# EAGLE design tt-motor_driver_and_encoder (EAGLE 9.6.2)
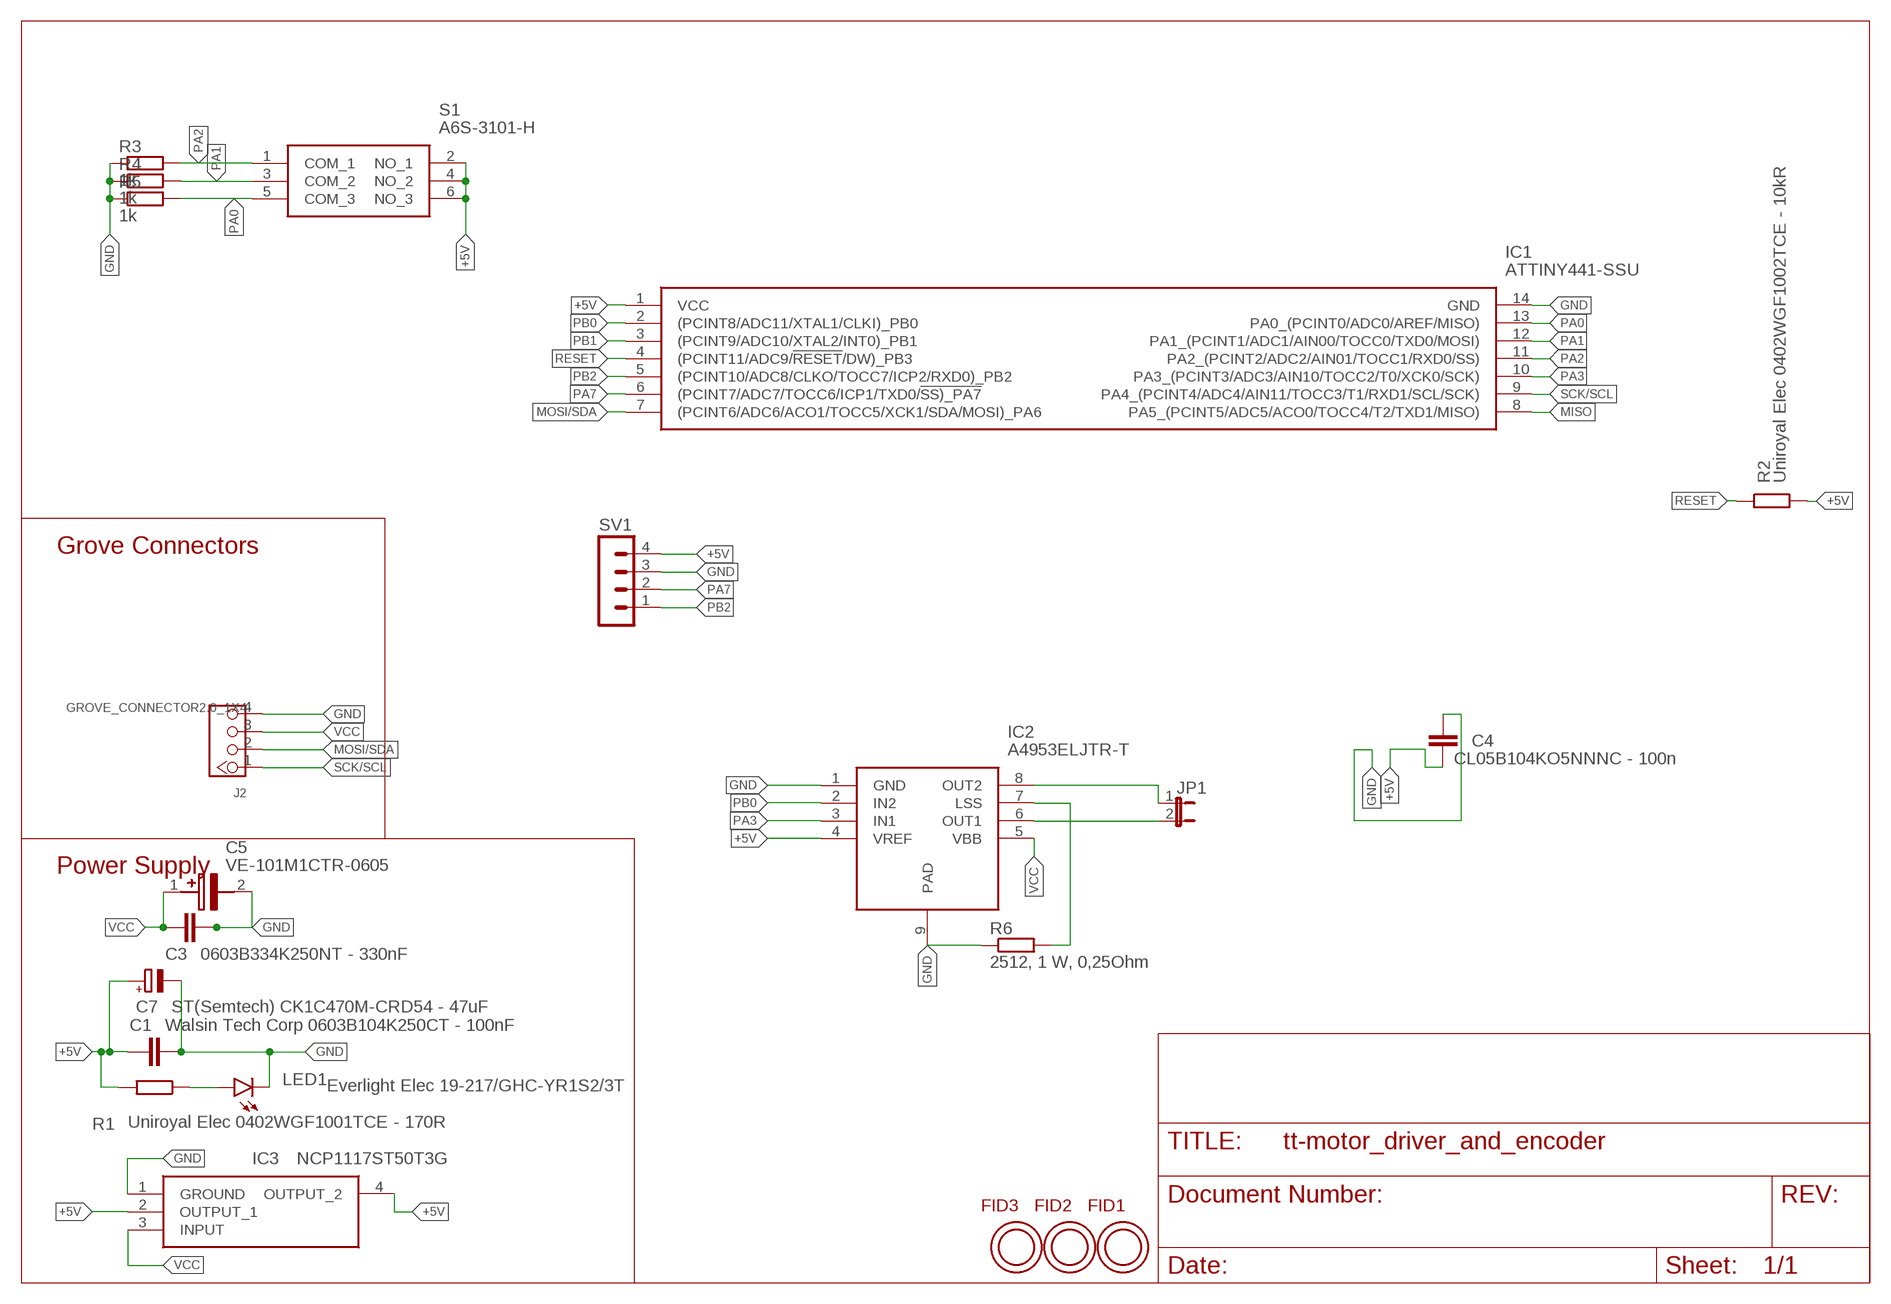
[diagram p0: schematic, sheet 1]

## Parts
C1  Walsin Tech Corp 0603B104K250CT - 100nF  C-EUC0603  [C0603]
C3  0603B334K250NT - 330nF  C-EUC0603  [C0603]
C4  CL05B104KO5NNNC - 100n  C-EUC0402  [C0402]
C5  VE-101M1CTR-0605  [CAPAE660X550N]
C7  ST(Semtech) CK1C470M-CRD54 - 47uF  CPOL-EUC  [PANASONIC_C]
FID1  OPEN-PNP-FIDUCIAL  [OPEN-PNP-FIDUCIAL]
FID2  OPEN-PNP-FIDUCIAL  [OPEN-PNP-FIDUCIAL]
FID3  OPEN-PNP-FIDUCIAL  [OPEN-PNP-FIDUCIAL]
IC1  ATTINY441-SSU  [SOIC127P600X175-14N]
IC2  A4953ELJTR-T  [SOIC127P600X170-9N]
IC3  NCP1117ST50T3G  [SOT230P700X180-4N]
J2  GROVE_CONNECTOR2.0_1X4  [2.0_1X4_STRAIGHT]
JP1  JP1E  [JP1]
LED1  Everlight Elec 19-217/GHC-YR1S2/3T  LEDCHIPLED_0603  [CHIPLED_0603]
R1  Uniroyal Elec 0402WGF1001TCE - 170R  R-EU_R0402  [R0402]
R2  Uniroyal Elec 0402WGF1002TCE - 10kR  R-EU_R0402  [R0402]
R3  1k  R-EU_R0402  [R0402]
R4  1k  R-EU_R0402  [R0402]
R5  1k  R-EU_R0402  [R0402]
R6  2512, 1 W, 0,25Ohm  R-EU_R2512  [R2512]
S1  A6S-3101-H  [A6S3104H]
SV1  MA04-1  [MA04-1]

## Nets
+5V: C1.1 C4.1 C7.+ IC1.1(VCC) IC2.4(VREF) IC3.2(OUTPUT_1) IC3.4(OUTPUT_2) R1.2 R2.2 S1.2(NO_1) S1.4(NO_2) S1.6(NO_3) SV1.4
GND: C1.2 C3.1 C4.2 C5.2(-) C7.- IC1.14(GND) IC2.1(GND) IC2.9(PAD) IC3.1(GROUND) J2.4 LED1.C R3.1 R4.1 R5.1 R6.1 SV1.3
MISO: IC1.8(PA5_(PCINT5/ADC5/ACO0/TOCC4/T2/TXD1/MISO))
MOSI/SDA: IC1.7((PCINT6/ADC6/ACO1/TOCC5/XCK1/SDA/MOSI)_PA6) J2.2
N$1: LED1.A R1.1
N$2: IC2.6(OUT1) JP1.2
N$3: IC2.8(OUT2) JP1.1
N$4: IC2.7(LSS) R6.2
PA0: IC1.13(PA0_(PCINT0/ADC0/AREF/MISO)) R5.2 S1.5(COM_3)
PA1: IC1.12(PA1_(PCINT1/ADC1/AIN00/TOCC0/TXD0/MOSI)) R4.2 S1.3(COM_2)
PA2: IC1.11(PA2_(PCINT2/ADC2/AIN01/TOCC1/RXD0/SS)) R3.2 S1.1(COM_1)
PA3: IC1.10(PA3_(PCINT3/ADC3/AIN10/TOCC2/T0/XCK0/SCK)) IC2.3(IN1)
PA7: IC1.6((PCINT7/ADC7/TOCC6/ICP1/TXD0/!SS)_PA7) SV1.2
PB0: IC1.2((PCINT8/ADC11/XTAL1/CLKI)_PB0) IC2.2(IN2)
PB1: IC1.3((PCINT9/ADC10/XTAL2/INT0)_PB1)
PB2: IC1.5((PCINT10/ADC8/CLKO/TOCC7/ICP2/RXD0)_PB2) SV1.1
RESET: IC1.4((PCINT11/ADC9/!RESET!/DW)_PB3) R2.1
SCK/SCL: IC1.9(PA4_(PCINT4/ADC4/AIN11/TOCC3/T1/RXD1/SCL/SCK)) J2.1
VCC: C3.2 C5.1(+) IC2.5(VBB) IC3.3(INPUT) J2.3

## Notes on the sheet
- Grove Connectors
- Power Supply

## Library data of the parts
C1 C3 C4 = rcl:C-EU: CAPACITOR, European symbol; SPICEPREFIX: C
C5 = samacsys:VE-101M1CTR-0605: Aluminum Electrolytic Capacitors - SMD 16 Volts 100uF 20% 6.3x5.3 Source: Datasheet <https://www.arrow.com/en/products/ve-101m1ctr-0605/lelon-electronics>; ARROW_PART_NUMBER: VE-101M1CTR-0605; ARROW_PRICE-STOCK: https://www.arrow.com/en/products/ve-101m1ctr-0605/lelon-electronics; DESCRIPTION: Aluminum Electrolytic Capacitors - SMD 16 Volts 100uF 20% 6.3x5.3; HEIGHT: 5.5mm; MANUFACTURER_NAME: Lelon; MANUFACTURER_PART_NUMBER: VE-101M1CTR-0605; MOUSER_PART_NUMBER: 140-VE101M1CTR0605; MOUSER_PRICE-STOCK: https://www.mouser.co.uk/ProductDetail/Lelon/VE-101M1CTR-0605/?qs=GtPRU6UQL8z3KVDPWnsarw%3D%3D
C7 = rcl:CPOL-EU: POLARIZED CAPACITOR, European symbol; SPICEPREFIX: C
FID1-FID3 = topo-eng:OPEN-PNP-FIDUCIAL
IC1 = samacsys:ATTINY441-SSU: 8-bit Microcontrollers - MCU 16MHz 0.150" 14 SOIC Source: Datasheet <http://docs-emea.rs-online.com/webdocs/1441/0900766b81441b76.pdf>; ARROW_PART_NUMBER: ATTINY441-SSU; ARROW_PRICE-STOCK: https://www.arrow.com/en/products/attiny441-ssu/microchip-technology; DESCRIPTION: 8-bit Microcontrollers - MCU 16MHz 0.150" 14 SOIC; HEIGHT: 1.75mm; MANUFACTURER_NAME: Microchip; MANUFACTURER_PART_NUMBER: ATTINY441-SSU; MOUSER_PART_NUMBER: 556-ATTINY441-SSU; MOUSER_PRICE-STOCK: https://www.mouser.co.uk/ProductDetail/Microchip-Technology-Atmel/ATTINY441-SSU/?qs=HVbQlW5zcXWQGPvGy4LqgA%3D%3D
IC2 = samacsys:A4953ELJTR-T: Full Bridge Motor Driver 8-Pin SOIC N EP Allegro Microsystems A4953ELJTR-T Brushed DC Motor Driver IC, 40 V 2A, 8-Pin SOIC Source: Datasheet <http://www.allegromicro.com/~/media/Files/Datasheets/A4950-Datasheet.ashx?la=en>; ARROW_PART_NUMBER: A4953ELJTR-T; ARROW_PRICE-STOCK: https://www.arrow.com/en/products/a4953eljtr-t/allegro-microsystems; DESCRIPTION: Full Bridge Motor Driver 8-Pin SOIC N EP Allegro Microsystems A4953ELJTR-T Brushed DC Motor Driver IC, 40 V 2A, 8-Pin SOIC; HEIGHT: 1.7mm; MANUFACTURER_NAME: Allegro Microsystems; MANUFACTURER_PART_NUMBER: A4953ELJTR-T
IC3 = samacsys:NCP1117ST50T3G: ON SEMICONDUCTOR - NCP1117ST50T3G - LDO, REG, 20VIN, 1A, 5V, 1%, SOT223-3 Source: Datasheet <http://www.onsemi.com/pub/Collateral/NCP1117-D.PDF>; ARROW_PART_NUMBER: NCP1117ST50T3G; ARROW_PRICE-STOCK: https://www.arrow.com/en/products/ncp1117st50t3g/on-semiconductor; DESCRIPTION: ON SEMICONDUCTOR - NCP1117ST50T3G - LDO, REG, 20VIN, 1A, 5V, 1%, SOT223-3; HEIGHT: 1.8mm; MANUFACTURER_NAME: ON Semiconductor; MANUFACTURER_PART_NUMBER: NCP1117ST50T3G; MOUSER_PART_NUMBER: 863-NCP1117ST50T3G; MOUSER_PRICE-STOCK: https://www.mouser.co.uk/ProductDetail/ON-Semiconductor/NCP1117ST50T3G?qs=Gev%252BmEvV0ib6dijy6U0dhQ%3D%3D
J2 = morphbot:GROVE_CONNECTOR: Seeedstudio Grove-Connector: 1 = SCL 2 = SDA 3 = VCC 4 = GND
JP1 = jumper:JP1E: JUMPER
LED1 = led:LED: LED OSRAM: - CHIPLED LG R971, LG N971, LY N971, LG Q971, LY Q971, LO R971, LY R971 LH N974, LH R974 LS Q976, LO Q976, LY Q976 LO Q996 - Hyper CHIPLED LW Q18S LB Q993, LB Q99A, LB R99A - SideLED LS A670, LO A670, LY A670, LG A670, LP A670 LB A673, LV A673, LT A673, LW A673 LH A674 LY A675 LS A676, LA A676, LO A676, LY A676, LW A676 LS A679, LY A679, LG A679 - Hyper Micro SIDELED® LS Y876, LA Y876, LO Y876, LY Y876 LT Y87S - SmartLED LW L88C, LW L88S LB L89C, LB L89S, LG L890 LS L89K, LO L89K, LY L89K LS L896, LA L896, LO L896, LY L896 - TOPLED LS T670, LO T670, LY T670, LG T670, LP T670 LSG T670, LSP T670, LSY T670, LOP T670, LYG T670 LG T671, LOG T671, LSG T671 LB T673, LV T673, LT T673, LW T673 LH T674 LS T676, LA T676, LO T676, LY T676, LB T676, LH T676, LSB T676, LW T676 LB T67C, LV T67C, LT T67C, LS T67K, LO T67K, LY T67K, LW E67C LS E67B, LA E67B, LO E67B, LY E67B, LB E67C, LV E67C, LT E67C LW T67C LS T679, LY T679, LG T679 LS T770, LO T770, LY T770, LG T770, LP T770 LB T773, LV T773, LT T773, LW T773 LH T774 LS E675, LA E675, LY E675, LS T675 LS T776, LA T776, LO T776, LY T776, LB T776 LHGB T686 LT T68C, LB T68C - Hyper Mini TOPLED® LB M676 - Mini TOPLED Santana® LG M470 LS M47K, LO M47K, LY M47K Source: http://www.osram.convergy.de LUXEON: - LUMILED® LXK2-PW12-R00, LXK2-PW12-S00, LXK2-PW14-U00, LXK2-PW14-V00 LXK2-PM12-R00, LXK2-PM12-S00, LXK2-PM14-U00 LXK2-PE12-Q00, LXK2-PE12-R00, LXK2-PE12-S00, LXK2-PE14-T00, LXK2-PE14-U00 LXK2-PB12-K00, LXK2-PB12-L00, LXK2-PB12-M00, LXK2-PB14-N00, LXK2-PB14-P00, LXK2-PB14-Q00 LXK2-PR12-L00, LXK2-PR12-M00, LXK2-PR14-Q00, LXK2-PR14-R00 LXK2-PD12-Q00, LXK2-PD12-R00, LXK2-PD12-S00 LXK2-PH12-R00, LXK2-PH12-S00 LXK2-PL12-P00, LXK2-PL12-Q00, LXK2-PL12-R00 Source: www.luxeon.com KINGBRIGHT: KA-3528ASYC Source: www.kingbright.com
R1-R6 = rcl:R-EU_: RESISTOR, European symbol; SPICEPREFIX: R
S1 = samacsys:A6S-3101-H: 3 Way Surface Mount DIP Switch 3P Source: Datasheet <https://omronfs.omron.com/en_US/ecb/products/pdf/en-a6s.pdf>; DESCRIPTION: 3 Way Surface Mount DIP Switch 3P; HEIGHT: 4.5mm; MANUFACTURER_NAME: Omron Electronics; MANUFACTURER_PART_NUMBER: A6S-3101-H; MOUSER_PART_NUMBER: 653-A6S-3101-H; MOUSER_PRICE-STOCK: https://www.mouser.co.uk/ProductDetail/Omron-Electronics/A6S-3101-H?qs=ZP3UR5XsUoc1g2fyRqfX8w%3D%3D
SV1 = con-lstb:MA04-1: PIN HEADER; OC_FARNELL: unknown; OC_NEWARK: unknown

## Board
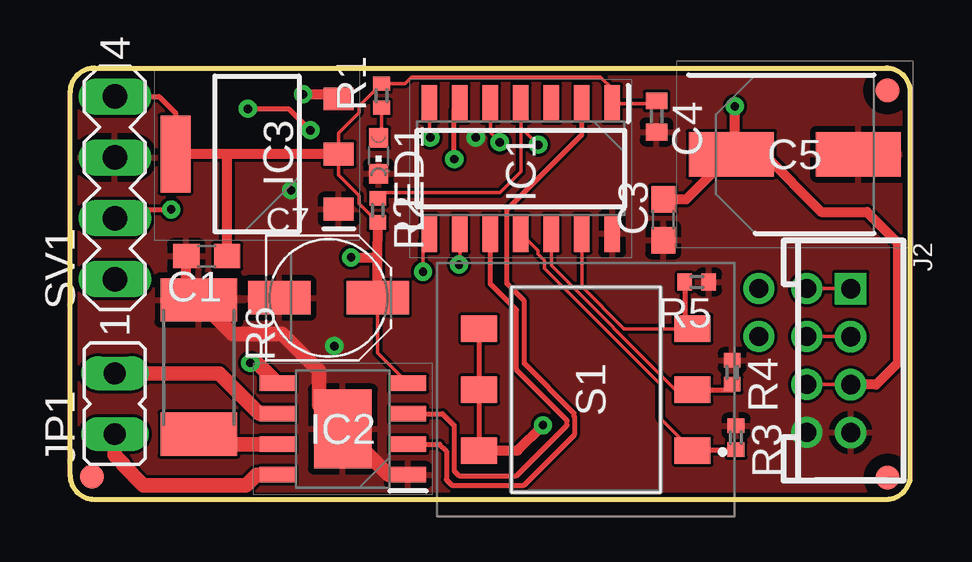
[diagram p1: board, top side]
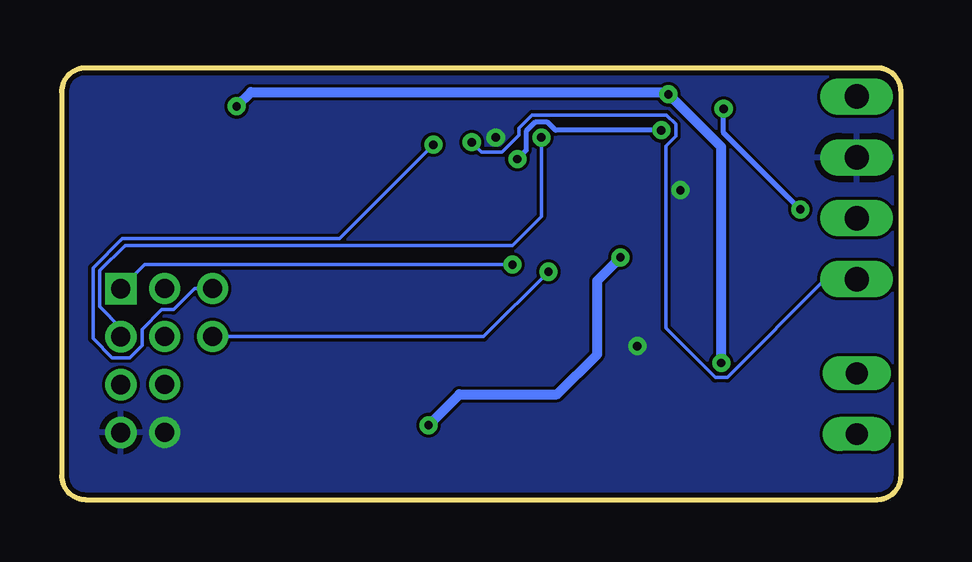
[diagram p2: board, bottom side, seen from below]

Size 35 x 18 mm. Coordinates in mm from the lower left corner, seen from the top.
Outline: 34,0 1,0 arc-90 0,1 0,17 arc-90 1,18 34,18 arc-90 35,17 35,1 arc-90 34,0
Copper layers (1*16): Top 0.035mm / dielectric 0.2mm / Bottom 0.035mm
Design rules "jlcpcb_4_layer *": minimum track width 3.5mil, minimum drill 0.2mm, track to track 5mil, track to pad 6mil, pad to pad 6mil, via to via 6mil, smd to smd 6mil, copper to edge 0.2mm, drill to drill 6mil, minimum pad ring 10mil, minimum via ring 8mil, stop-mask expansion 4mil, vias tented up to drill 0mil, thermal gap 10mil

### Footprints (pad centres in the part's own frame; a part is rotated, then mirrored left to right if it is on the bottom)
C0603 = smd 1.1 x 1: 1 -0.85,0; 2 0.85,0
C0402 = smd 0.7 x 0.9: 1 -0.65,0; 2 0.65,0
CAPAE660X550N = smd 3.55 x 1.85: 1 -2.65,0; 2 2.65,0
PANASONIC_C = smd 2.6 x 1.4: + 2.05,0; - -2.05,0
OPEN-PNP-FIDUCIAL = smd 1 x 1: FID$1 0,0
SOIC127P600X175-14N = smd 1.528 x 0.65: 1 -2.711,3.81; 2 -2.711,2.54; 3 -2.711,1.27; 4 -2.711,0; 5 -2.711,-1.27; 6 -2.711,-2.54; 7 -2.711,-3.81; 8 2.711,-3.81; 9 2.711,-2.54; 10 2.711,-1.27; 11 2.711,0; 12 2.711,1.27; 13 2.711,2.54; 14 2.711,3.81
SOIC127P600X170-9N = smd 1.525 x 0.65: 1 -2.712,1.905; 2 -2.712,0.635; 3 -2.712,-0.635; 4 -2.712,-1.905; 5 2.712,-1.905; 6 2.712,-0.635; 7 2.712,0.635; 8 2.712,1.905 | smd 2.41 x 3.3: 9 0,0
SOT230P700X180-4N = smd 1.25 x 0.95: 1 -3.4,2.3; 2 -3.4,0; 3 -3.4,-2.3 | smd 1.25 x 3.2: 4 3.4,0
2.0_1X4_STRAIGHT = drill 0.8 pad 1.27 square: 1 1.83,-1.786 | drill 0.8 pad 1.27: 2 3.83,-1.786; 3 5.83,-1.786; 4 7.83,-1.786
JP1 = drill 0.914 long: 1 0,-1.27; 2 0,1.27
CHIPLED_0603 = smd 0.8 x 0.8: A 0,-0.75; C 0,0.75
R0402 = smd 0.6 x 0.7: 1 -0.5,0; 2 0.5,0
R2512 = smd 1.8 x 3.2: 1 -2.8,0; 2 2.8,0
A6S3104H = smd 1.1 x 1.5: 1 -2.54,-4.45; 2 -2.54,4.45; 3 0,-4.45; 4 0,4.45; 5 2.54,-4.45; 6 2.54,4.45
MA04-1 = drill 1.016 long: 1 -3.81,0; 2 -1.27,0; 3 1.27,0; 4 3.81,0

### Placement (x,y rotation side)
C1  5.68,10.15 180 top
C3  24.72,11.67 90 top
C4  24.44,15.98 270 top
C5  30.2,14.4 0 top
C7  10.76,8.41 0 top
FID1  34.07,0.91 0 top
FID2  0.89,0.95 0 top
FID3  34.06,17.07 0 top
IC1  18.78,13.81 270 top
IC2  11.36,2.94 180 top
IC3  7.78,14.41 180 top
J2  34.31,10.63 270 top
JP1  1.85,4 0 top
LED1  12.84,14.34 180 top
R1  12.97,16.85 90 top
R2  12.81,12.06 270 top
R3  27.75,2.58 270 top
R4  27.58,5.31 270 top
R5  26.11,9.07 180 top
R6  5.35,5.53 270 top
S1  21.49,4.58 90 top
SV1  1.85,13 90 top

### Tracks (layer width: path | path; a pad name or v marks a point on that pad's centre or on a via)
+5V  (via drill 0.35)
  Top 0.152: R2.2 12.03,12.34 12.03,12.68 11.18,13.53 IC3.2 11.18,15.29 12.03,16.14 12.03,16.41 R1.2 13.95,17.34 14.22,17.62 22.1,17.62 22.59,17.14 IC1.1 24.32,16.52 C4.1 | C7.+ 12.81,7.26 | 12.81,7.26 12.79,7.25 | 12.79,7.25 12.79,6.12 | 12.79,6.12 IC2.4 | C7.+ 12.81,7.26 | 12.81,7.26 12.79,7.25 | 12.79,7.25 12.79,6.12 | 12.79,6.12 IC2.4 | C7.+ 12.81,7.26 | 12.81,7.26 12.79,7.25 | 12.79,7.25 12.79,6.12 | 12.79,6.12 IC2.4
  Top 0.2: S1.6 S1.4 17.04,4.5 S1.2 | SV1.4 3.69,16.81 4.38,16.12 IC3.4
  Top 0.406: IC3.2 6.5,14.41 | 6.5,14.41 IC3.4 | C1.1 6.53,14.38 6.5,14.41 | C7.+ 12.81,8.83 12.81,10 | 12.81,10 R2.2 | S1.2 18.64,2.04 v19.7,3.1 | v11.7,10.1 12.71,10.1 12.81,10
  Bottom 0.406: v19.7,3.1 18.41,4.39 14.34,4.39 12.67,6.06 12.67,9.13 v11.7,10.1
GND  (via drill 0.35, 0.8 pad 1.3)
  Top 0.406: R6.1 4.83,8.85 C1.2
  Top 0.61: 13.26,1.04 IC2.9 10.36,3.94 10.36,5.37 8.82,6.92 6.76,6.92 R6.1
  other vias: 30.7,2.8 16.9,15.1 9.2,12.9 11,6.4
  pour Top: 0,0 0,18.5 35.6,18.5 35.6,0
  pour Bottom: 0,-0.1 0,18.6 35.6,18.6 35.6,-0.1
MISO  (via drill 0.35, 0.8 pad 1.3)
  Top 0.152: v14.7,9.5 14.7,10.83 IC1.8
  Bottom 0.152: v28.7,6.8 17.4,6.8 v14.7,9.5
MOSI/SDA  (via drill 0.35, 0.8 pad 1.3)
  Top 0.152: IC1.7 14.97,15.13 v15,15.1 | v30.7,6.8 J2.2
  Bottom 0.152: v15,15.1 15,11.8 16.2,10.6 32.36,10.6 33.41,9.54 33.41,8.05 32.53,7.17 J2.2
N$1
  Top 0.152: R1.1 12.97,15.21 LED1.A
N$2
  Top 0.61: JP1.2 6.2,5.27 7.89,3.58 IC2.6
N$3
  Top 0.61: IC2.8 7.77,1.04 7.33,0.6 3.04,0.6 2.2,1.45 2.2,1.49 1.85,1.84 JP1.1
N$4
  Top 0.61: IC2.7 5.77,2.31 R6.2
PA0
  Top 0.152: S1.5 23.08,7.12 21.32,8.88 IC1.13
  Top 0.2: S1.5 25.61,7.45 R5.2
PA1
  Top 0.152: S1.3 25.22,4.58 20.05,9.76 IC1.12
  Top 0.2: S1.3 27.67,4.58 27.74,4.65 R4.2
PA2
  Top 0.152: S1.1 24.6,3.38 24.6,4.81 19.77,9.64 19.77,9.96 19.49,10.24 19.49,10.38 IC1.11
  Top 0.2: S1.1 27.62,2.04 27.7,2.13 R3.2
PA3
  Top 0.2: IC2.3 15.52,3.58 16,3.1 16,1.2 16.2,1 18.6,1 20.7,3.1 20.7,3.3 18.6,5.4 18.6,7.9 17.51,8.99 IC1.10
PA7  (via drill 0.35)
  Top 0.2: SV1.2 2.22,12.1 v4.2,12.1 | v7.4,16.3 9.1,16.3 v10,15.4 | v16,14.2 16,16.28 IC1.6
  Bottom 0.2: v4.2,12.1 7.4,15.3 v7.4,16.3 | v10,15.4 14.41,15.4 14.74,15.73 15.26,15.73 15.63,15.36 15.63,14.57 v16,14.2
PB0
  Top 0.2: IC1.2 21.32,15.22 18.2,12.1 18.2,9 18.93,8.27 18.93,5.67 21,3.6 21,3.46 21.03,3.44 21.03,2.73 18.9,0.6 15.9,0.6 15.67,0.83 15.67,2.03 15.39,2.31 IC2.2
PB2  (via drill 0.35)
  Top 0.152: v17.9,14.9 17.51,15.29 17.51,15.35 IC1.5
  Bottom 0.152: SV1.1 3.15,9.19 7.25,5.09 7.75,5.09 9.81,7.15 9.81,14.73 9.39,15.15 9.39,15.65 9.78,16.03 15.39,16.03 15.93,15.49 15.93,15.21 16.65,14.49 17.49,14.49 v17.9,14.9
RESET  (via drill 0.35, 0.8 pad 1.3)
  Top 0.152: R2.1 13.05,12.8 14.1,12.8 17.9,12.8 18.78,13.68 18.78,15.5 | 18.78,15.5 IC1.4 | v19.5,14.8 18.8,15.5 18.78,15.5
  Bottom 0.152: v19.5,14.8 23.42,10.88 32.47,10.88 33.69,9.66 33.69,6.71 32.9,5.91 32.16,5.91 31.65,6.43 31.65,7.1 30.82,7.92 30.34,7.92 29.46,8.8 v28.7,8.8
SCK/SCL  (via drill 0.35, 0.8 pad 1.3)
  Top 0.152: IC1.9 16.24,9.84 v16.2,9.8 | v30.7,8.8 J2.1
  Bottom 0.152: J2.1 31.52,9.8 v16.2,9.8
VCC  (via drill 0.35, 0.8 pad 1.3)
  Top 0.152: v30.7,4.8 J2.3
  Top 0.406: C5.1 28.9,14.4 31.3,12 33.2,12 34.5,10.7 34.5,5.7 33.59,4.8 J2.3 | C5.1 27.7,14.55 v27.7,16.4 | v9.7,16.9 10.99,16.9 IC3.3 | C5.1 25.67,12.52 C3.2
  Top 0.61: IC2.5 7.79,5.7 v7.5,5.7
  Bottom 0.406: v27.7,16.4 27.1,17 9.8,17 v9.7,16.9 7.5,14.7 v7.5,5.7